# EAGLE design DRUM_1_MAIN_6 (EAGLE 9.6.2)
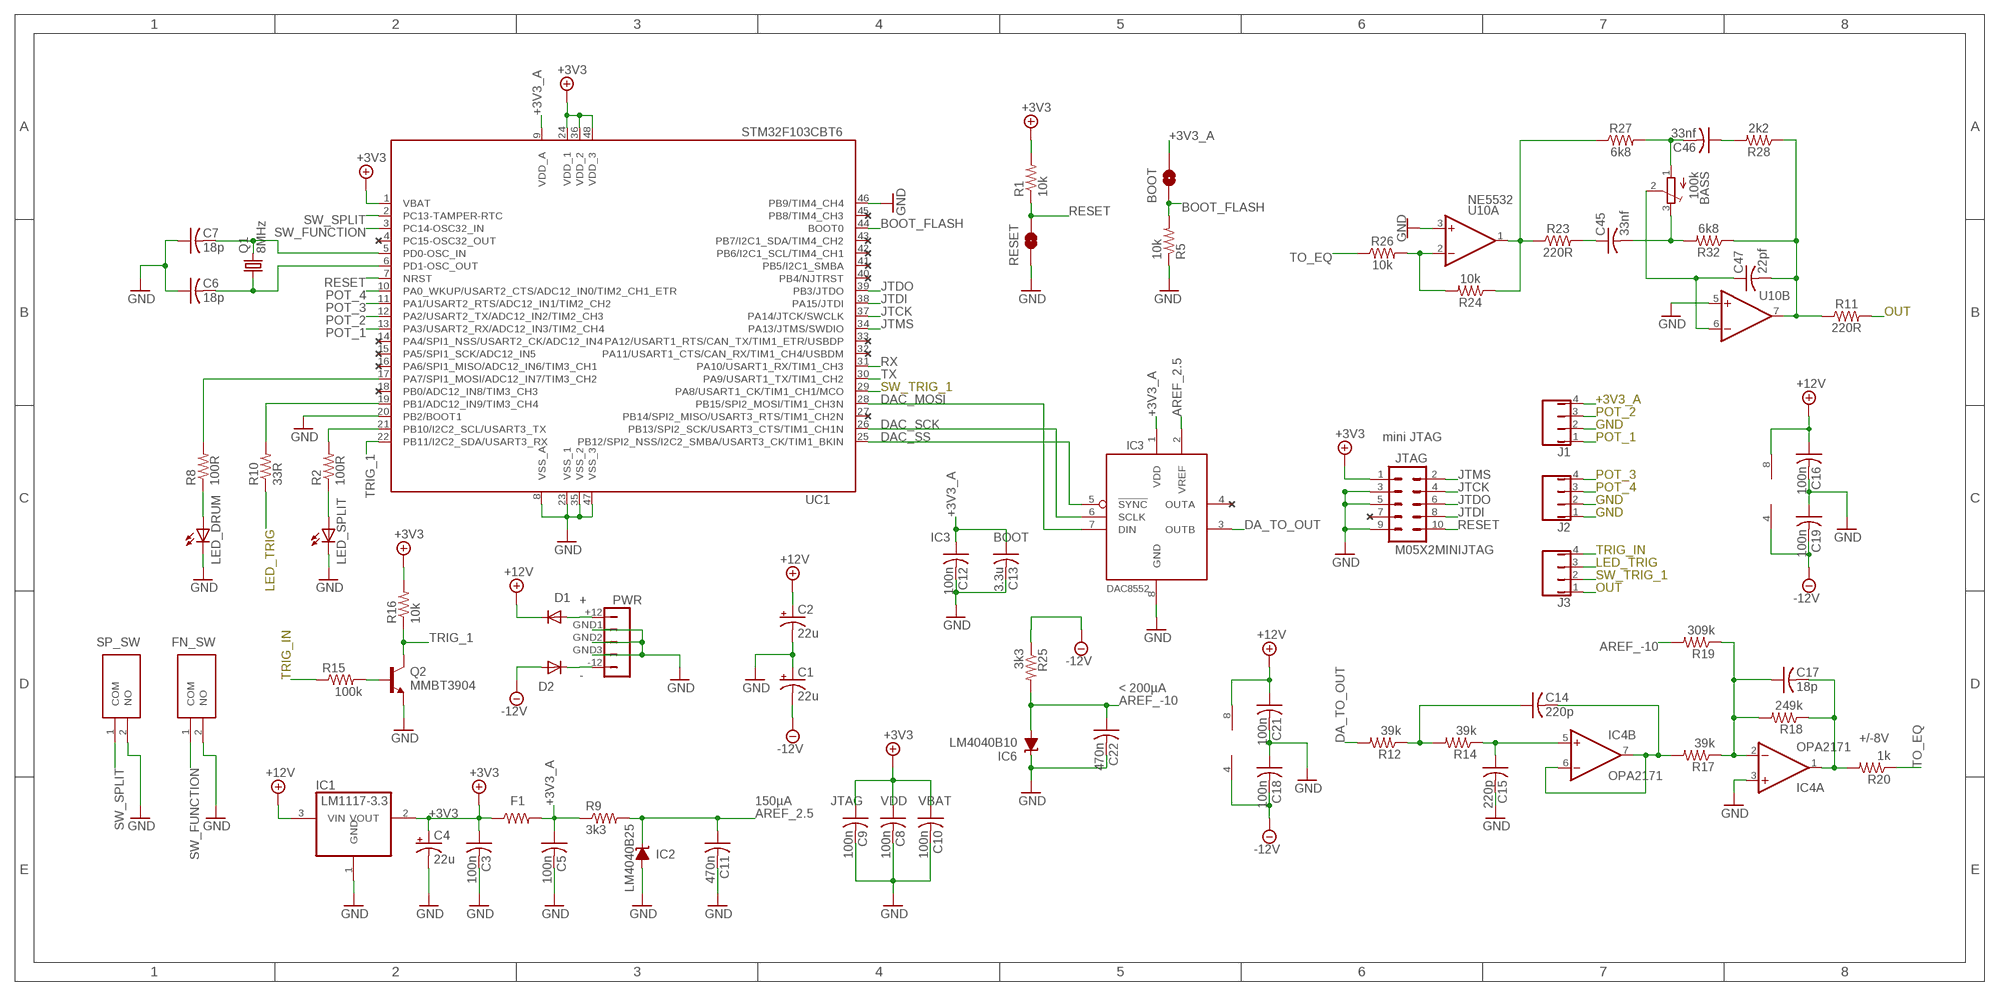
[diagram p0: schematic, sheet 1]

## Parts
BASS  100k  ADAFRUIT_TRIMPOTTC33X  [ADAFRUIT_TC33X]
BOOT  BOOT  JUMPER-SMT_2_NO_SILK  [SMT-JUMPER_2_NO_SILK]
C1  22u  CPOL-USC  [PANASONIC_C]
C2  22u  CPOL-USC  [PANASONIC_C]
C3  100n  C-USC0603  [C0603]
C4  22u  CPOL-USC  [PANASONIC_C]
C5  100n  C-USC0603  [C0603]
C6  18p  C-USC0603  [C0603]
C7  18p  C-USC0603  [C0603]
C8  100n  C-USC0603  [C0603]
C9  100n  C-USC0603  [C0603]
C10  100n  C-USC0603  [C0603]
C11  470n  C-USC0603  [C0603]
C12  100n  C-USC0603  [C0603]
C13  3.3u  C-USC0805K  [C0805K]
C14  220p  C-USC0603  [C0603]
C15  220p  C-USC0603  [C0603]
C16  100n  C-USC0603  [C0603]
C17  18p  C-USC0603  [C0603]
C18  100n  C-USC0603  [C0603]
C19  100n  C-USC0603  [C0603]
C21  100n  C-USC0603  [C0603]
C22  470n  C-USC0603  [C0603]
C45  33nf  C-USC0603  [C0603]
C46  33nf  C-USC0603  [C0603]
C47  22pf  C-USC0603  [C0603]
D1  1N5819HW  PWR_DIODE  [PNS40010ER_SOD123W]
D2  1N5819HW  PWR_DIODE  [PNS40010ER_SOD123W]
F1  742792693  R-US_R0603  [R0603]
FN_SW  PTS636_SM25_SMTR_LFS C778169  PTS636_SM25_SMTR_LFS  [PTS636SM25SMTRLFS]
IC1  LM1117-3.3  REG1117  [SOT223]
IC2  LM4040B25  LM4041B12DBZ  [DBZ_R-PDSO-G3]
IC3  DAC8552  [MSOP-8]
IC4  OPA2171  TL072D  [SO08]
IC6  LM4040B10  LM4041B12DBZ  [DBZ_R-PDSO-G3]
J1  1x4 FEMALE HEADER  JMP/4P/SIP  [JMP/4P/SIP]
J2  1x4 FEMALE HEADER  JMP/4P/SIP  [JMP/4P/SIP]
J3  1x4 FEMALE HEADER  JMP/4P/SIP  [JMP/4P/SIP]
JTAG  M05X2MINIJTAG  [2X5-1.27]
LED_DRUM  LEDS0805  [LED_0805A]
LED_SPLIT  LEDS0805  [LED_0805A]
PWR  JMP/5P/DIP1X5_HEADER  [JMP/5P/DIP]
Q1  8MHz  CRYSTALHC49UP  [HC49UP]
Q2  MMBT3904  MMBT3904LT1-NPN-SOT23-BEC  [SOT23-BEC]
R1  10k  R-US_R0603  [R0603]
R2  100R  R-US_R0603  [R0603]
R5  10k  R-US_R0603  [R0603]
R8  100R  R-US_R0603  [R0603]
R9  3k3  R-US_R0603  [R0603]
R10  33R  R-US_R0603  [R0603]
R11  220R  R-US_R0603  [R0603]
R12  39k  R-US_R0603  [R0603]
R14  39k  R-US_R0603  [R0603]
R15  100k  R-US_R0603  [R0603]
R16  10k  R-US_R0603  [R0603]
R17  39k  R-US_R0603  [R0603]
R18  249k  R-US_R0603  [R0603]
R19  309k  R-US_R0603  [R0603]
R20  1k  R-US_R0603  [R0603]
R23  220R  R-US_R0603  [R0603]
R24  10k  R-US_R0603  [R0603]
R25  3k3  R-US_R0603  [R0603]
R26  10k  R-US_R0603  [R0603]
R27  6k8  R-US_R0603  [R0603]
R28  2k2  R-US_R0603  [R0603]
R32  6k8  R-US_R0603  [R0603]
RESET  RESET  JUMPER-SMT_2_NO_SILK  [SMT-JUMPER_2_NO_SILK]
SP_SW  PTS636_SM25_SMTR_LFS C778169  PTS636_SM25_SMTR_LFS  [PTS636SM25SMTRLFS]
U10  NE5532  TL072D  [SO08]
UC1  STM32F103CBT6  STM32F103CB  [LQFP48]

## Nets
+ [+]: D1.2(A) PWR.+12
+3V3 [+3v3]: C3.1 C4.+ C8.1 C9.1 C10.1 F1.1 IC1.2(VOUT) JTAG.1 R1.2 R16.2 UC1.1(VBAT) UC1.24(VDD_1) UC1.36(VDD_2) UC1.48(VDD_3)
+3V3_A [+3V3A]: BOOT.2 C5.1 C12.1 C13.1 F1.2 IC3.1(VDD) J1.4 R9.1 UC1.9(VDD_A)
+12V [+12V]: C2.+ C16.1 C21.1 D1.1(K) IC1.3(VIN) IC4.8(P:V+) U10.8(P:V+)
- [-]: D2.1(K) PWR.-12
-12V [-12V]: C1.- C18.2 C19.2 D2.2(A) IC4.4(P:V-) R25.1 U10.4(P:V-)
AREF_2.5: C11.1 IC2.1(C) IC3.2(VREF) R9.2
AREF_-10: C22.1 IC6.2(A) R19.2 R25.2
BI_OUT: C17.2 IC4.1(A:OUT) R18.1 R20.2
BOOT_FLASH: BOOT.1 R5.2 UC1.44(BOOT0)
DA_TO_OUT: IC3.3(OUTB) R12.2
DAC_MOSI: IC3.7(DIN) UC1.28(PB15/SPI2_MOSI/TIM1_CH3N)
DAC_SCK: IC3.6(SCLK) UC1.26(PB13/SPI2_SCK/USART3_CTS/TIM1_CH1N)
DAC_SS: IC3.5(!SYNC) UC1.25(PB12/SPI2_NSS/I2C2_SMBA/USART3_CK/TIM1_BKIN)
F_CV: C17.1 IC4.2(A:-IN) R17.1 R18.2 R19.1
GND [GND]: C1.+ C2.- C3.2 C4.- C5.2 C6.1 C7.1 C8.2 C9.2 C10.2 C11.2 C12.2 C13.2 C15.2 C16.2 C18.1 C19.1 C21.2 C22.2 FN_SW.2(NO) IC1.1(GND) IC2.2(A) IC3.8(GND) IC4.3(A:+IN) IC6.1(C) J1.2 J2.1 J2.2 JTAG.3 JTAG.5 JTAG.9 LED_DRUM.-(C) LED_SPLIT.-(C) PWR.GND1 PWR.GND2 PWR.GND3 Q2.E R5.1 RESET.1 SP_SW.2(NO) U10.3(A:+IN) U10.5(B:+IN) UC1.8(VSS_A) UC1.20(PB2/BOOT1) UC1.23(VSS_1) UC1.35(VSS_2) UC1.46(PB9/TIM4_CH4) UC1.47(VSS_3)
JTCK: JTAG.4 UC1.37(PA14/JTCK/SWCLK)
JTDI: JTAG.8 UC1.38(PA15/JTDI)
JTDO: JTAG.6 UC1.39(PB3/JTDO)
JTMS: JTAG.2 UC1.34(PA13/JTMS/SWDIO)
LED_TRIG: J3.3 R10.1
N$1: R24.2 R26.2 U10.2(A:-IN)
N$6: LED_DRUM.+(A) R8.1
N$7: C7.2 Q1.2 UC1.5(PD0-OSC_IN)
N$8: C6.2 Q1.1 UC1.6(PD1-OSC_OUT)
N$9: R10.2 UC1.19(PB1/ADC12_IN9/TIM3_CH4)
N$13: R8.2 UC1.17(PA7/SPI1_MOSI/ADC12_IN7/TIM3_CH2)
N$14: Q2.B R15.2
N$18: LED_SPLIT.+(A) R2.1
N$19: R2.2 UC1.21(PB10/I2C2_SCL/USART3_TX)
N$42: C14.2 IC4.6(B:-IN) IC4.7(B:OUT) R17.2
N$43: C15.1 IC4.5(B:+IN) R14.1
N$45: C14.1 R12.1 R14.2
N$78: C47.2 R11.1 R28.1 R32.1 U10.7(B:OUT)
N$87: BASS.2 C47.1 U10.6(B:-IN)
N$134: R23.1 R24.1 R27.1 U10.1(A:OUT)
N$146: C45.1 R23.2
N$147: BASS.1 C46.2 R27.2
N$148: BASS.3 C45.2 R32.2
N$150: C46.1 R28.2
OUT: J3.1 R11.2
POT_1: J1.1 UC1.13(PA3/USART2_RX/ADC12_IN3/TIM2_CH4)
POT_2: J1.3 UC1.12(PA2/USART2_TX/ADC12_IN2/TIM2_CH3)
POT_3: J2.4 UC1.11(PA1/USART2_RTS/ADC12_IN1/TIM2_CH2)
POT_4: J2.3 UC1.10(PA0_WKUP/USART2_CTS/ADC12_IN0/TIM2_CH1_ETR)
RESET: JTAG.10 R1.1 RESET.2 UC1.7(NRST)
RX: UC1.31(PA10/USART1_RX/TIM1_CH3)
SW_FUNCTION: FN_SW.1(COM) UC1.3(PC14-OSC32_IN)
SW_SPLIT: SP_SW.1(COM) UC1.2(PC13-TAMPER-RTC)
SW_TRIG_1: J3.2 UC1.29(PA8/USART1_CK/TIM1_CH1/MCO)
TO_EQ: R20.1 R26.1
TRIG_1: Q2.C R16.1 UC1.22(PB11/I2C2_SDA/USART3_RX)
TRIG_IN: J3.4 R15.1
TX: UC1.30(PA9/USART1_TX/TIM1_CH2)
Unconnected: IC3.4(OUTA) JTAG.7 UC1.4(PC15-OSC32_OUT) UC1.14(PA4/SPI1_NSS/USART2_CK/ADC12_IN4) UC1.15(PA5/SPI1_SCK/ADC12_IN5) UC1.16(PA6/SPI1_MISO/ADC12_IN6/TIM3_CH1) UC1.18(PB0/ADC12_IN8/TIM3_CH3) UC1.27(PB14/SPI2_MISO/USART3_RTS/TIM1_CH2N) UC1.32(PA11/USART1_CTS/CAN_RX/TIM1_CH4/USBDM) UC1.33(PA12/USART1_RTS/CAN_TX/TIM1_ETR/USBDP) UC1.40(PB4/NJTRST) UC1.41(PB5/I2C1_SMBA) UC1.42(PB6/I2C1_SCL/TIM4_CH1) UC1.43(PB7/I2C1_SDA/TIM4_CH2) UC1.45(PB8/TIM4_CH3)

## Notes on the sheet
- mini JTAG
- IC3 | BOOT
- < 200µA
- +/-8V
- 150µA | JTAG | VDD | VBAT

## Library data of the parts
BASS = AA_Stobbert_1:ADAFRUIT_TRIMPOT: SMT trimmer potentiometer part number TC33X http://www.ladyada.net/library/eagle
BOOT RESET = SparkFun-Jumpers:JUMPER-SMT_2_NO: Normally open jumper This jumper has two pads in close proximity to each other. Apply solder to close the connection. Round pads are easier to solder for beginners, but are a lot larger. SparkFun Product that uses the round pads: SparkFun EL Sequencer <https://www.sparkfun.com/products/12781>
C1 C2 C4 = rcl:CPOL-US: POLARIZED CAPACITOR, American symbol
C3 C5-C19 C21 C22 C46 = AA_Stobbert_1:C-US: CERAMIC CAPACITOR
C45 C47 = AA_Stobbert:C-US: CAPACITOR, American symbol
D1 D2 = AA_Stobbert_1:PWR_DIODE: 400 V, 1 A high power diode High power density, standard switching time PN-rectifier with high-efficiency planar technology, encapsulated in a small and flat lead SOD123W Surface-Mounted Device (SMD) plastic package. AAL Eindhoven MK
F1 R1 R2 R5 R8-R12 R14-R20 R23-R28 R32 = AA_Stobbert_1:R-US_: RESISTOR, 1%, 1/10 W
FN_SW SP_SW = SamacSys_Parts:PTS636_SM25_SMTR_LFS: Tactile Switches Tact 50mA 12VDC, 6.0x3.5, 2.5mm H, 180gf, G leads, No ground pin, White Actuator Source: Datasheet <https://componentsearchengine.com/Datasheets/1/PTS636 SM25 SMTR LFS.pdf>; DESCRIPTION: Tactile Switches Tact 50mA 12VDC, 6.0x3.5, 2.5mm H, 180gf, G leads, No ground pin, White Actuator; HEIGHT: 2.7mm; MANUFACTURER_NAME: C & K COMPONENTS; MANUFACTURER_PART_NUMBER: PTS636 SM25 SMTR LFS; MOUSER_PART_NUMBER: 611-PTS636SM25SMTRLF; MOUSER_PRICE-STOCK: https://www.mouser.co.uk/ProductDetail/CK/PTS636-SM25-SMTR-LFS?qs=vLWxofP3U2yIXR4iooxesw%3D%3D
IC1 = og-vreg:REG1117: 800mA and 1A Low Dropout (LDO) Positive Regulator 1.8V, 2.5V, 2.85V, 3.3V, 5V, and Adj
IC2 IC6 = texas:LM4041: PRECISION MICROPOWER SHUNT VOLTAGE REFERENCE Source: http://focus.ti.com/lit/ds/slcs146e/slcs146e.pdf
IC3 = og-dac:DAC8552
IC4 = linear:TL072: OP AMP
J1-J3 = AA_Stobbert_1:JMP/4P/SIP
JTAG = og-header:M05X2: Header 5x2 Standard 10-pin dual row 0.1" header. Commonly used with AVR-ISP. Use with Spark Fun Electronics SKU: PRT-00778
LED_DRUM LED_SPLIT = AA_Stobbert_1:LEDS
PWR = AA_Stobbert_1:JMP/5P/DIP
Q1 = crystal:CRYSTAL: CRYSTAL
Q2 = transistor:*-NPN-: NPN Transistror BF959 corrected 2008.03.06
U10 = TomW:TL072: OP AMP
UC1 = stm32:STM32F103CB

## Net classes
0 default: width 0.254 mm
1 +12V: width 0.305 mm
2 -12V: width 0.305 mm
3 +3v3: width 0.305 mm
4 +3V3A: width 0.305 mm
5 GND: width 0.254 mm
6 +: width 0.61 mm
7 -: width 0.61 mm

## Board
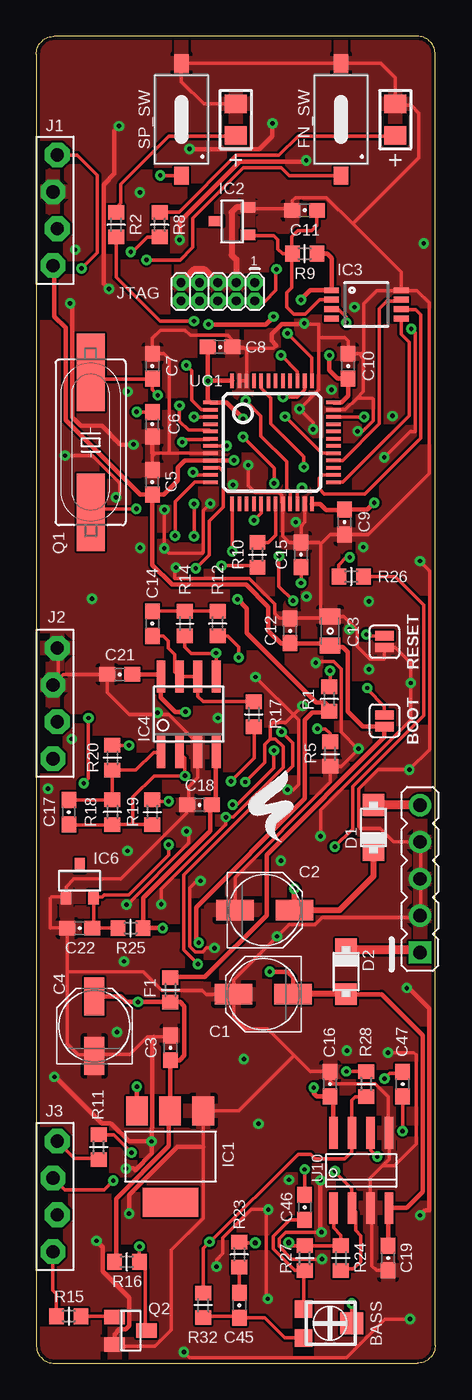
[diagram p1: board, top side]
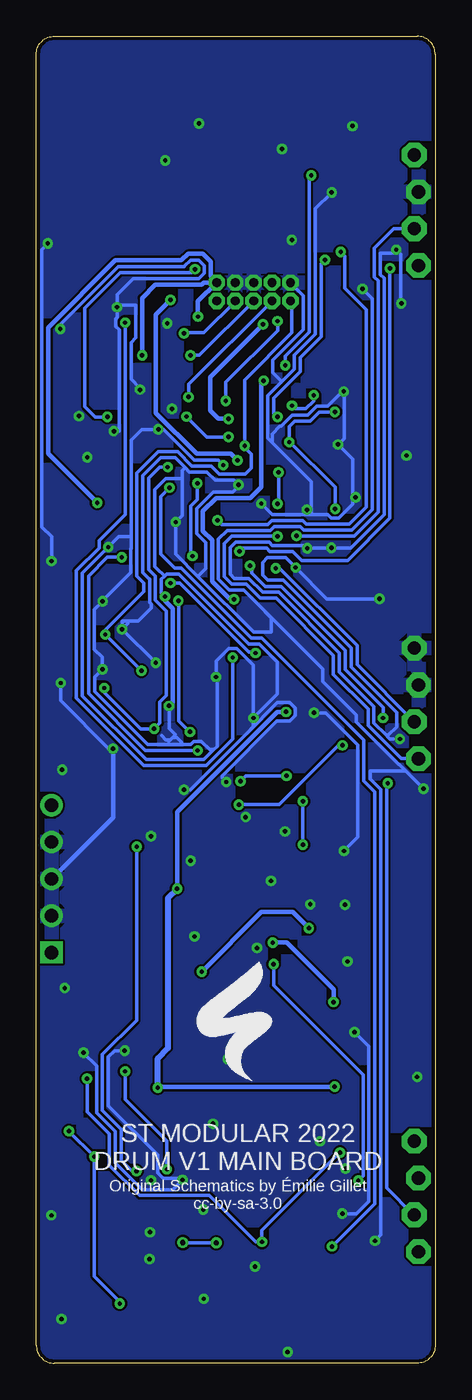
[diagram p2: board, bottom side, seen from below]

Size 27.5 x 91.5 mm. Coordinates in mm from the lower left corner, seen from the top.
Outline: 1.25,0 26.25,0 arc90 27.5,1.25 27.5,47.95 27.5,90.25 arc90 26.25,91.5 1.25,91.5 arc90 0,90.25 0,1.25 arc90 1.25,0
Copper layers (1*16): Top 0.035mm / dielectric 1.5mm / Bottom 0.035mm
Design rules "default *": minimum track width 6mil, minimum drill 0.3mm, track to track 6mil, track to pad 6mil, pad to pad 6mil, via to via 6mil, smd to smd 6mil, copper to edge 10mil, drill to drill 6mil, minimum pad ring 10mil, minimum via ring 8mil, stop-mask expansion 4mil, vias tented up to drill 15mil, thermal gap 10mil

### Footprints (pad centres in the part's own frame; a part is rotated, then mirrored left to right if it is on the bottom)
ADAFRUIT_TC33X = smd 1.2 x 1.2: 1 -1,-1.825; 3 1,-1.825 | smd 1.5 x 1.6: 2 0,1.5
SMT-JUMPER_2_NO_SILK = smd 0.635 x 1.27: 1 -0.406,0; 2 0.406,0
PANASONIC_C = smd 2.6 x 1.4: + 2.05,0; - -2.05,0
C0603 = smd 1.1 x 1: 1 -0.85,0; 2 0.85,0
C0805K = smd 1.1 x 1.4: 1 -1,0; 2 1,0
PNS40010ER_SOD123W = smd 1.5 x 1.5: 1 -1.55,0; 2 1.55,0
R0603 = smd 1 x 1.1: 1 -0.85,0; 2 0.85,0
PTS636SM25SMTRLFS = smd 1.25 x 1: 1 -3.875,0; 2 3.875,0
SOT223 = smd 1.499 x 2.007: 1 -2.261,-3.15; 2 0.025,-3.15; 3 2.311,-3.15 | smd 3.81 x 2.007: 4 0,3.15
DBZ_R-PDSO-G3 = smd 0.7 x 1: 1 -0.95,-1.1; 2 0.95,-1.1; 3 0,1.1
MSOP-8 = smd 0.41 x 1.02: 1 -0.975,-2.4; 2 -0.325,-2.4; 3 0.325,-2.4; 4 0.975,-2.4; 5 0.975,2.4; 6 0.325,2.4; 7 -0.325,2.4; 8 -0.975,2.4
SO08 = smd 0.6 x 2.2: 1 -1.905,-2.6; 2 -0.635,-2.6; 3 0.635,-2.6; 4 1.905,-2.6; 5 1.905,2.6; 6 0.635,2.6; 7 -0.635,2.6; 8 -1.905,2.6
JMP/4P/SIP = drill 0.914 pad 1.7 octagon: 1 -3.81,0.15; 2 -1.27,-0.15; 3 1.27,0.15; 4 3.81,-0.15
2X5-1.27 = drill 0.61 pad 1.067 octagon: 1 -1.27,3.81; 2 0,3.81; 3 -1.27,2.54; 4 0,2.54; 5 -1.27,1.27; 6 0,1.27; 7 -1.27,0; 8 0,0; 9 -1.27,-1.27; 10 0,-1.27
LED_0805A = smd 1.27 x 1.524: + 1.091,0; - -1.091,0
JMP/5P/DIP = drill 0.914 pad 1.524: +12 0,-5.08; GND1 0,2.54; GND2 0,0; GND3 0,-2.54 | drill 0.914 pad 1.524 square: -12 0,5.08
HC49UP = smd 5.334 x 1.93: 1 -4.826,0; 2 4.826,0
SOT23-BEC = smd 1 x 1.4: B -0.95,-1.1; C 0,1.1; E 0.95,-1.1
LQFP48 = smd 0.254 x 1: 1 -2.75,-4.25; 2 -2.25,-4.25; 3 -1.75,-4.25; 4 -1.25,-4.25; 5 -0.75,-4.25; 6 -0.25,-4.25; 7 0.25,-4.25; 8 0.75,-4.25; 9 1.25,-4.25; 10 1.75,-4.25; 11 2.25,-4.25; 12 2.75,-4.25; 25 2.75,4.25; 26 2.25,4.25; 27 1.75,4.25; 28 1.25,4.25; 29 0.75,4.25; 30 0.25,4.25; 31 -0.25,4.25; 32 -0.75,4.25; 33 -1.25,4.25; 34 -1.75,4.25; 35 -2.25,4.25; 36 -2.75,4.25 | smd 1 x 0.254: 13 4.25,-2.75; 14 4.25,-2.25; 15 4.25,-1.75; 16 4.25,-1.25; 17 4.25,-0.75; 18 4.25,-0.25; 19 4.25,0.25; 20 4.25,0.75; 21 4.25,1.25; 22 4.25,1.75; 23 4.25,2.25; 24 4.25,2.75; 37 -4.25,2.75; 38 -4.25,2.25; 39 -4.25,1.75; 40 -4.25,1.25; 41 -4.25,0.75; 42 -4.25,0.25; 43 -4.25,-0.25; 44 -4.25,-0.75; 45 -4.25,-1.25; 46 -4.25,-1.75; 47 -4.25,-2.25; 48 -4.25,-2.75

### Placement (x,y rotation side)
BASS  20.25,2.75 270 top
BOOT  24,44.3 270 top
C1  15.65,25.45 180 top
C2  15.75,31.25 0 top
C3  9.25,21.75 90 top
C4  4,23.25 90 top
C5  8,60.75 90 top
C6  8,64.75 90 top
C7  8,68.75 270 top
C8  12.67,70.07 0 top
C9  21.25,58 270 top
C10  21.5,68.75 90 top
C11  18.5,79.5 180 top
C12  17.5,50.5 90 top
C13  20.25,50.5 90 top
C14  8,51 270 top
C15  18.25,55.75 90 top
C16  20.25,19.25 90 top
C17  2.25,38 90 top
C18  11.25,38.5 0 top
C19  24.25,7.25 90 top
C21  5.75,47.5 180 top
C22  3,30 180 top
C45  14,4 270 top
C46  18.5,10.75 270 top
C47  25.25,19.25 90 top
D1  23.25,36.95 90 top
D2  21.35,27 270 top
F1  9.25,25.75 90 top
FN_SW  21,85.75 90 top
IC1  9.25,14.25 180 top
IC2  13.5,78.75 90 top
IC3  22.75,73 270 top
IC4  10.5,44.75 0 top
IC6  3,33.25 0 top
J1  1.3,79.5 270 top
J2  1.3,45.5 270 top
J3  1.3,11.5 270 top
JTAG  11.25,73.25 270 top
LED_DRUM  24.75,85.75 270 top
LED_SPLIT  13.75,85.75 270 top
PWR  26.45,33.4 180 top
Q1  3.75,63.5 90 top
Q2  6.5,2.25 270 top
R1  20.2,45.8 270 top
R2  5.5,78.5 270 top
R5  20.25,42 90 top
R8  8.5,78.5 270 top
R9  18.5,76.5 180 top
R10  15.25,55.75 90 top
R11  4.3,14.9 270 top
R12  12.5,51 270 top
R14  10.25,51 90 top
R15  2.25,3.25 0 top
R16  6.25,7 180 top
R17  15,44.75 90 top
R18  5.25,38 270 top
R19  8,38 90 top
R20  5.25,41.75 270 top
R23  14,7.5 270 top
R24  21,7.25 270 top
R25  6.5,30 180 top
R26  21.7,54.25 0 top
R27  18.5,7.25 270 top
R28  22.75,19.25 90 top
R32  11.5,4 270 top
RESET  24,49.75 90 top
SP_SW  10,85.75 90 top
U10  22.4,13.3 0 top
UC1  16.25,63.5 270 top

### Tracks (layer width: path | path; a pad name or v marks a point on that pad's centre or on a via)
+
  Top 0.61: D1.2 26.38,38.5 PWR.+12
+3V3  (via drill 0.3)
  Top 0.305: UC1.36 21.03,66.25 21.5,66.72 C10.1 20.79,67.9 20.2,68.49 v20.2,69.5 | UC1.24 19.57,59.25 19.98,58.84 C9.1 22.82,58.85 v23.3,59.33 | R16.2 5.5,7 5.5,11.35 9.12,14.98 9.12,17.38 IC1.2 9.25,17.5 9.25,20.88 C3.1 9.9,20.9 10.21,21.22 10.21,24.62 9.94,24.9 F1.1 v7.01,24.91 6.2,24.91 5.81,25.3 C4.+ | C8.1 11.83,70.05 v11.83,67.75 | v16.36,72.17 15.81,71.62 v11.88,71.62 | v11.2,29 11.02,29.19 11.02,31.45 18.51,38.93 18.51,44.37 19.02,44.88 20.12,44.88 R1.2 20.2,45.24 19.89,45.56 19.29,45.56 14.5,50.34 14.5,52.05 v13.88,52.68 | v11.83,67.75 11.83,66.42 UC1.1 13.12,66.25 v14.25,65.12 | v11.83,67.75 UC1.48
  Bottom 0.305: v20.2,69.5 20.2,73.46 19.29,74.37 16.11,74.37 15.96,74.52 JTAG.1 | v11.2,29 10.23,29 7.01,25.78 v7.01,24.91 | v11.88,71.62 15.5,68.01 15.5,65.67 14.95,65.12 v14.25,65.12 | v16.36,72.17 16.36,73.22 JTAG.1 | v11.83,67.75 11.98,67.6 11.98,60.41 12.73,59.65 15.11,59.65 16.01,58.75 16.01,57.39 15.38,56.76 15.38,53.89 14.17,52.68 v13.88,52.68 | v23.3,59.33 26.69,62.72 26.69,71.41 22.05,76.05 17.49,76.05 17.04,76.5 16.9,76.5 16.89,76.5 16.04,76.5 15.49,75.95 15.49,74.95 JTAG.1
+3V3_A  (via drill 0.3)
  Top 0.305: F1.2 9.25,26.62 11.62,26.62 15.88,30.88 15.88,35.04 24,43.17 BOOT.2 22.5,43.89 21.46,44.93 21.46,49.03 21.11,49.38 20.25,49.38 C13.1 20.12,49.62 17.5,49.62 C12.1 17.38,49.62 16.88,49.62 16.01,50.49 16.01,52.14 14.47,53.68 9.37,53.68 8,55.05 C5.1 | R9.1 20.05,76.5 20.36,76.19 20.36,73.98 IC3.1 20.34,73.98 18.9,73.98 v18.24,73.33 | v13.62,62.25 12.12,62.25 UC1.9 10.25,62.25 9.76,61.76 9.76,60.88 8.78,59.9 C5.1 | J1.4 1.25,75.62 1.25,72.17 2.02,71.39 2.02,65.04 7.17,59.9 C5.1
  Bottom 0.305: v18.24,73.33 19.26,72.31 19.26,65.53 16.44,62.71 14.08,62.71 v13.62,62.25
+12V  (via drill 0.3)
  Top 0.305: C21.1 8.38,47.5 8.5,47.38 IC4.8 8.6,45.91 9.6,44.91 v10.28,44.91 | U10.8 20.48,15.91 20.48,18.14 20.25,18.38 C16.1 19.34,18.4 19.12,18.62 v19.12,19 | v6.93,19.07 v6.94,19.06 IC1.3 | C2.+
  Top 0.406: v17.79,32.71 C2.+ | C2.+ 20.91,31.25 23.25,33.59 D1.1
  Bottom 0.305: v19.12,19 19.06,19.07 v6.93,19.07 | v10.28,44.91 10.9,44.91 17.79,38.02 v17.79,32.71
  Bottom 0.406: v19.12,19 19.12,21.03 18.43,21.73 18.43,32.08 v17.79,32.71
-
  Top 0.61: D2.1 21.38,28.5 26.25,28.5 26.38,28.38 PWR.-12
-12V  (via drill 0.3)
  Top 0.305: IC4.4 12.38,42.12 12.38,38.88 12.12,38.62 C18.2 12,38.5 12,36.71 7.38,32.09 7.38,30 R25.1 7.5,30 v8.71,30 | C19.2 24.25,8.12 24.25,10.62 U10.4 25.53,10.7 26.64,11.81 26.64,22.62 23.81,25.45 D2.2 21.25,25.5 | 17.75,25.5 C1.- 17.7,26.62 17.33,26.99 v16.09,26.99
  Top 0.406: 17.75,25.5 21.25,25.5
  Bottom 0.305: v8.71,30 9.82,31.11 11.98,31.11 v16.09,26.99
AREF_2.5
  Top 0.254: IC2.1 14.62,77.75 16.38,77.75 16.66,77.46 16.66,76.81 16.98,76.5 17.62,76.5 | 17.62,76.5 R9.2 17.62,76.38 17.62,74.18 17.25,73.81 17.25,72.83 17.74,72.34 18.55,72.34 19.54,73.33 IC3.2 | C11.1 19.35,78.44 18.99,78.09 18.02,78.09 17.62,77.69 17.62,76.5
AREF_-10  (via drill 0.3)
  Top 0.254: v9.12,38.75 8,38.75 R19.2 | R25.2 C22.1 3.95,30.1 IC6.2 4.53,32.15 4.69,32.3 6.38,32.3 9.14,35.06 9.14,35.73 v9.12,35.75
  Bottom 0.254: v9.12,35.75 v9.12,38.75
BI_OUT
  Top 0.254: IC4.1 8.5,42.12 8.1,42.12 6.87,40.9 R20.2 R18.1 C17.2
BOOT_FLASH  (via drill 0.3)
  Top 0.254: v18.44,61.8 18.44,62.52 16.18,64.78 16.18,66.55 15.5,67.22 UC1.44 | v19.38,43.75 19.93,43.75 20.25,43.43 R5.2 | v22.82,46.56 22.82,46.48 24,45.3 BOOT.1
  Bottom 0.254: v22.82,46.56 22.82,46.25 20.32,43.75 v19.38,43.75 18.98,44.15 18.98,45.59 18.54,46.03 18.54,51.87 19.29,52.62 19.29,54.27 19.75,54.73 19.75,61.04 18.99,61.8 v18.44,61.8
DA_TO_OUT  (via drill 0.3)
  Top 0.254: v21.38,71.75 21.38,72.12 20.88,72.62 20.38,72.62 IC3.3 | v13.96,48.67 13.96,49.4 13.21,50.15 R12.2
  Bottom 0.254: v21.38,71.75 21.38,58.5 23.17,56.71 23.17,56.23 24.75,54.65 24.75,45.87 20.09,41.21 15.78,41.21 13.96,43.03 v13.96,48.67
DAC_MOSI
  Top 0.254: UC1.28 21.12,62.25 23.65,64.78 23.65,72.73 24.17,73.25 25.12,73.25 IC3.7
DAC_SCK
  Top 0.254: UC1.26 19.71,61.25 19.5,61.04 19.5,60.3 19.86,59.94 22.65,59.94 26.52,63.8 26.52,72.32 26.17,72.66 25.18,72.66 IC3.6
DAC_SS
  Top 0.254: UC1.25 21.12,60.75 25.7,65.33 25.7,70.41 25.15,70.96 IC3.5
F_CV  (via drill 0.3)
  Top 0.254: C17.1 2.25,37.12 5.25,37.12 R18.2 5.32,37.14 6.67,37.14 | 6.67,37.14 8,37.14 R19.1 | IC4.2 9.88,42.12 10.25,41.75 v10.25,40.5 10.12,40.5 8.12,40.5 6.67,39.04 6.67,37.14 | R17.1 15.01,41.72 v13.43,40.14
  Bottom 0.254: v13.43,40.14 13.05,40.51 10.26,40.51 v10.25,40.5
GND  (via drill 0.3)
  Top 0.254: LED_SPLIT.- 11.53,86.84 10,88.38 SP_SW.2 FN_SW.2 23.75,89.62 24.75,88.62 LED_DRUM.- 24.75,86.75 25.83,86.75 26.38,86.21 26.38,83.12 21.81,78.56 | 17.5,51.38 20.12,51.38 C13.2 | 17.5,51.38 C12.2 | C13.2 19.62,51.5 19.62,56.47 | 14.56,79.74 IC2.2 14.62,79.62 17.5,79.62 17.62,79.5 C11.2 17.65,80.15 17.88,80.38 20,80.38 21.81,78.56 | UC1.8 9.16,62.75 9.16,62.76 | 8,63.88 C6.1 | 9.16,62.76 9.16,69.23 8.78,69.6 C7.1 8,70.68 8.57,71.25 10.25,71.25 10.62,70.88 13.21,70.88 13.52,70.56 C8.2 | UC1.47 UC1.46 14.5,69.85 14.28,70.07 C8.2 | UC1.35 21.31,65.75 22.11,66.55 | 22.11,66.55 22.54,66.98 22.54,69.27 22.21,69.6 C10.2 | 16.55,70.17 16.38,70 13.75,70 C8.2 | J2.1 1.5,49.25 1.5,47.25 J2.2 1.25,46.88 1.88,47.5 C21.2 4.9,46.25 6.4,44.75 9.12,44.75 11.12,42.75 11.12,42.25 IC4.3 11.12,42.12 11.12,40.38 10.5,39.75 10.5,38.5 C18.1 10.38,38.38 10.38,37.96 5.82,33.4 2.59,33.4 2.05,32.86 IC6.1 1.06,32.15 0.95,32.05 0.95,30 C22.2 2.12,29.88 2.12,27 | Q2.E 5.52,1.18 7.14,1.18 8.18,1.18 9.32,2.32 9.32,7.82 11.5,10 11.5,14.93 11.5,17.38 IC1.1 13.96,17.4 17.78,21.22 | C3.2 9.25,22.5 8.1,22.5 7.63,22.5 6.45,21.31 4.11,21.31 C4.- 4,21.25 2.91,21.25 2.12,22.03 2.12,27 | 13.75,31.25 C2.- 13.7,33.52 20.25,40.06 R5.1 21.04,41.15 22.21,42.32 v22.21,42.37 | C19.1 23.46,6.4 23.12,6.73 23.12,10.62 U10.3 23.03,10.71 23.03,12.78 23.85,13.6 | 23.85,13.6 24.31,14.06 24.31,15.89 U10.5 24.25,16 24.25,18.38 23.38,19.25 20.48,19.25 20.25,19.48 C16.2 20.25,20.12 18.88,20.12 17.78,21.22 | 17.78,21.22 16.56,22.44 15.93,23.07 14.44,23.07 13.6,23.91 C1.+ | 14,25 C1.+ | v22.21,42.37 22.32,42.26
  Top 0.254: 2.12,27 7.38,27 8.65,25.72 11.45,25.72 11.71,25.45 C1.+ | IC3.8 26.24,73.97 27.09,73.13 27.09,61.34 22.9,57.15 C9.2 21.25,57.12 20.28,57.12 19.62,56.47 | IC3.8 25.15,75.22 21.81,78.56 | IC3.8 23.48,73.97 22.56,73.05 22.56,69.77 22.39,69.6 C10.2 | C10.2 21.5,70.49 21.28,70.71 19.49,70.71 | 18.47,71.66 19.49,71.66 19.49,70.71 | C15.2 17.43,56.6 17,57.03 UC1.20 16.91,59.34 16.91,59.87 16.74,60.03 15.09,60.03 14.61,60.51 v14.61,61.93 | C15.2 18.25,57.74 18.5,57.99 UC1.23 | C15.2 19.5,56.6 19.62,56.47 | C13.2 21.19,51.5 22.11,50.58 22.11,49.41 22.97,48.55 24,48.55 RESET.1 24.75,49.34 25.81,48.28 v25.81,46.91 25.81,44.35 19.6,38.14 v19.6,36.34 | C1.+ 13.6,26.44 17.43,30.27 19.22,30.27 19.7,30.75 26.38,30.75 PWR.GND1 26.5,30.88 26.5,33.38 PWR.GND2 26.5,33.5 26.5,35.88 PWR.GND3 24.65,35.94 23.7,36.89 22.34,36.89 22.22,37.01 22.22,39.59 23.56,40.93 v25.72,40.93 27.12,42.33 27.12,54.63 v26.44,55.31 | 9.16,62.76 9.15,62.75 8.19,62.75 | 8.19,62.75 8,62.75 | v17.32,39.54 17.7,39.54 18.08,39.92 18.08,44.34 v15.1,47.31 | 19.49,70.71 19.49,67.14 v18.15,65.81 19.09,64.87 v19.09,64.39 | v6.23,31.62 6.28,31.62 10.53,35.86 10.53,36.51 v10.36,36.68 | v12.29,28.63 11.73,28.63 11.47,28.37 10.94,28.37 10.57,28.74 10.57,32.77 11.06,33.26 v11.31,33.26 | v8.61,31.64 8.61,32.7 13.07,37.15 v13.07,37.66 13.58,37.66 17.01,41.09 17.01,42.51 16.49,43.03 16.12,43.03 | v12.43,6.67 12.43,7.15 12.85,7.57 12.85,8.65 14.8,10.6 v15.99,10.6 15.84,10.45 15.84,4.56 v15.95,4.44 | v10.17,0.78 10.57,0.38 21.37,0.38 24.04,3.05 v25.77,3.05 | C5.2 8,62.56 8.19,62.75 | v22.15,64.27 22.51,64.27 23.23,64.99 23.23,66.48 23.16,66.55 22.11,66.55
  Top 0.254: v23.98,62.46 25.77,64.24 26.11,64.24 26.11,71.06 v25.85,71.32 | v5.5,59.71 5.76,59.97 5.76,60.69 3.87,62.58 v1.98,62.58 | v19.27,48.3 19.35,48.38 20.51,48.38 21.03,47.87 21.03,43.52 22.17,42.37 v22.21,42.37 | 23.85,13.6 24.67,13.6 26.2,15.13 26.2,21.25 26.03,21.42 v24.25,21.42 | v11.99,59.27 11.51,58.79 11.51,55.92 11.47,55.88 9.14,55.88 v8.82,56.2 8.82,58.84 v8.83,58.85 | v9.62,54.86 9.55,54.8 9.55,54.12 14.67,54.12 16.44,52.35 16.44,51.69 16.75,51.38 17.5,51.38 | 16.12,43.03 16.12,43.96 16.32,44.17 17.18,44.17 v18.35,45.33 | 16.12,43.03 15.74,42.66 15.74,41.42 v14.4,40.08 | v19.7,7.18 17.61,7.18 16.74,8.05 16.74,8.59 17.18,9.03 v19.67,9.03
  Top 0.305: C6.1 8,62.75 | v5.7,85.31 5.39,85 5.39,82.03 4.64,81.28 4.64,74.44 v5.01,74.07 | v9.88,77.46 9.88,78.71 14.03,82.86 18.53,82.86 v18.61,82.93 | v10.56,83.73 12.85,83.73 12.86,83.72 15.38,83.72 16.28,84.62 v16.28,85.49 | v6.7,63.35 5.8,63.35 4.5,64.66 3.07,64.66 2.48,65.24 2.48,72.93 v2.34,73.08 | v26.46,10.2 26.81,10.55 27.09,10.55 27.09,24.47 25.69,25.88 v25.54,25.88 | v19.59,12.62 19.59,9.11 v19.67,9.03 | v6.4,10.31 6.4,11.61 9.72,14.93 11.5,14.93 | v7.95,15.3 6.4,15.3 5.15,16.55 4.51,16.55 1.31,19.75 v1.25,19.75 | v7.95,15.3 7.95,16.23 7.99,16.27 7.99,22.39 8.1,22.5 | v6.18,13.43 6.7,13.43 6.82,13.31 7.97,14.47 7.97,15.28 v7.95,15.3 | v4.16,8.45 4.59,8.01 4.59,6.32 6.41,4.51 6.41,2.57 6.16,2.33 5.73,2.33 5.4,2 Q2.E | 18.47,71.66 16.92,71.66 16.22,70.97 16.22,70.51 16.55,70.17
  Top 0.406: JTAG.9 10.34,74.88 10.34,74.9 10.87,75.43 11.63,75.43 12.16,74.9 12.16,74.88 JTAG.5 JTAG.3 13.79,76.1 13.47,76.42 13.47,79.36 13.81,79.7 IC2.2
  Bottom 0.254: v25.81,46.91 25.81,45.68 22.5,42.37 v22.21,42.37 | v2.34,73.08 2.38,73.12 2.38,76.48 v2.69,76.78 2.75,76.85 | v11.99,59.27 11.23,58.51 8.54,58.51 | 8.54,58.51 7.4,58.51 7.16,58.28 6.64,58.28 5.68,59.24 5.68,62.33 v6.7,63.35 6.29,63.77 6.29,66.98 v6.31,67 6.42,67 7.42,66.01 8.15,66.01 8.78,65.38 9.85,65.38 10.61,64.62 10.7,64.62 11.24,64.08 11.24,63.5 9.95,62.22 | 8.54,58.51 8.54,60.8 9.95,62.22 | v26.44,55.31 26.44,56.99 27.12,57.67 27.12,76.8 v26.71,77.21 | 15.26,42.31 15.95,41.62 19.92,41.62 24.32,46.02 24.32,54.5 v22.53,56.28 21.83,56.99 20.97,56.99 20.97,57.14 | 15.26,42.31 15.04,42.53 15.04,47.25 v15.1,47.31 15.1,48.42 14.22,49.3 13.7,49.3 12.53,48.13 v12.53,44.5 | v17.32,39.54 16.88,39.54 12.95,43.47 | 12.95,43.47 12.53,43.89 v12.53,44.5 | v18.35,45.33 18.35,43.78 17.91,43.34 18.09,43.16 | 18.09,43.16 18.26,42.98 | 18.26,42.98 18.38,42.86 | 18.26,42.98 18.56,42.98 18.86,43.28 | 18.09,43.16 17.83,43.16 17.48,42.81 | v4.16,8.45 3.75,8.85 3.75,39.57 4.47,40.29 4.47,40.85 2.04,40.85 v0.82,39.62 2.48,41.28 2.52,41.28 5.45,44.21 5.45,44.69 7.76,47 7.76,47.87 12.21,52.32 | v6.3,35.33 5.33,36.3 5.33,42.63 7.55,44.85 v8.36,44.85 | v24.25,21.42 23.34,20.52 23.34,17.27 22.05,15.98 22.05,13.82 20.21,11.97 18.09,11.97 v17.42,12.64 17.51,12.74 18.76,12.74 19.13,13.11 19.13,14.36 22.53,17.76 22.53,21.12 22.11,21.55 v21.41,21.55 | v6.4,10.31 5.43,10.31 4.57,11.18 4.57,21.83 v5.56,22.83 | 2.62,76.56 3.79,76.56 3.79,75.07 3.53,74.82 3.53,58.53 5.83,56.23 v7.16,56.23 7.19,56.2 v8.82,56.2 9.01,56.39 11.24,56.39 11.46,56.61 13.76,56.61 14.13,56.24 14.13,54.4 13.85,54.12 12.86,54.12 11.9,53.16 10.79,53.16 6.61,48.98 6.61,47.67 4.23,45.28 4.23,44.16 3.37,43.3 3.29,43.3
  Bottom 0.254: v5.01,74.07 4.34,73.41 4.34,58.88 5.76,57.46 9.07,57.46 9.31,57.7 11.09,57.7 11.36,57.43 14.33,57.43 14.95,56.81 14.95,54.07 14.19,53.31 13.2,53.31 12.21,52.32 | v3.84,52.71 7.47,52.71 v9.62,54.86 v9.62,54.87 10.29,55.54 11.57,55.54 11.9,55.22 11.9,54.36 11.53,54 10.48,54 5.8,49.31 5.8,48 2.66,44.87 2.66,43.88 3.24,43.3 3.29,43.3 | v2.44,43.05 3.13,43.05 3.29,43.2 3.29,43.3 | v12.53,44.5 10.88,46.14 10.88,48.36 12.13,49.6 12.85,49.6 17.68,54.43 18.51,54.43 18.69,54.25 | v18.62,52.87 18.88,53.12 18.88,54.06 18.69,54.25 | 15.26,42.31 15.54,42.31 16.12,42.88 16.64,42.88 16.87,42.66 19.81,42.66 23.48,46.32 23.48,47.31 v22.94,47.85 22.94,48.68 23.49,49.23 23.49,51.97 v22.93,52.54 22.93,52.58 20.97,54.54 20.97,56.18 20.97,56.95 20.97,57.14 | 20.97,57.14 20.97,63.43 20.97,63.66 20.24,64.39 v19.09,64.39 18.73,64.39 16.62,62.28 14.96,62.28 v14.61,61.93 | 9.95,62.22 11.54,63.81 11.54,66.71 10.57,67.69 | JTAG.9 9.09,73.63 9.09,71.27 11.2,69.16 11.2,68.31 10.57,67.69 | v7.14,80.73 8.26,79.6 8.26,70.95 9.71,69.5 9.71,68.55 10.57,67.69 | v19.27,48.3 21.57,50.6 | 21.57,50.6 v21.59,50.6 21.18,51.02 21.18,51.18 | v14.4,40.08 14.7,40.37 14.7,40.5 10.92,44.28 10.02,44.28 9.65,44.65 9.65,45.17 10.02,45.54 10.88,45.54 12.95,43.47 | v20.35,67.13 20.35,67.23 20.97,67.85 20.97,70.37 20.63,70.71 20.63,72.93 20.65,72.95 21.81,72.95 v21.93,72.82 | v22.15,64.27 21.8,64.27 21.78,64.28 21.78,71.26 22.01,71.49 22.01,72.01 21.93,72.09 v21.93,72.82 | 21.57,50.6 21.57,51.18 21.18,51.18 | 17.24,61.75 16.95,61.46 15.74,61.46 15.16,60.89 13.87,60.89 v13.56,60.57 13.56,60.47 13.94,60.09 15.29,60.09 16.44,58.93 16.44,57.21 15.81,56.58 15.81,54.81 16.36,54.26
  Bottom 0.254: 17.24,61.75 17.93,62.44 18.93,62.44 20.15,61.21 20.15,54.53 19.7,54.08 19.69,54.08 19.69,52.45 19.58,52.34 19.58,52.07 20.47,51.18 21.18,51.18 | 12.21,52.32 11.29,51.4 11.29,50.41 12.52,50.41 16.36,54.26 | 16.36,54.26 17.89,55.79 v17.89,57.99 v17.88,58 17.43,58.45 17.43,61.11 | 17.24,61.75 17.43,61.55 17.43,61.11 | 18.69,54.25 18.69,54.3 19.14,54.76 19.33,54.95 19.33,60.26 18.58,61.01 17.53,61.01 17.43,61.11 | v21.93,72.82 21.93,73.67 20.8,74.8 16.29,74.8 15.92,75.17 15.92,75.7 16.29,76.07 16.86,76.07 17.29,75.64 17.29,75.61 21.86,75.61 25.85,71.63 v25.85,71.32
  Bottom 0.305: PWR.GND2 22.21,37.64 v22.21,42.37 | v18.35,45.33 18.11,45.57 18.11,52.05 18.62,52.56 v18.62,52.87
  other vias: 15.31,16.52 14.31,20.97 6.05,27.7 16.59,29.43 16.86,34.65 18.48,71.7 24.55,65.32
  pour Top: -1,93.5 -1,-1.5 29,-1.5 29,93.5
  pour Bottom: -2,95.5 -2,-2.5 30,-2.5 30,95.5
JTCK  (via drill 0.3)
  Top 0.254: UC1.37 19,69.33 v17.32,71
  Bottom 0.254: v17.32,71 17.28,71.05 15.95,71.05 13.75,73.25 JTAG.4
JTDI  (via drill 0.3)
  Top 0.254: UC1.38 18.5,67.12 18,66.62 v17,66.62
  Bottom 0.254: v17,66.62 17,67.5 JTAG.8
JTDO  (via drill 0.3)
  Top 0.254: UC1.39 18,68.38 v16.88,69.5
  Bottom 0.254: v16.88,69.5 16.25,69.5 12.5,73.25 JTAG.6
JTMS  (via drill 0.3)
  Top 0.254: v22.6,65.25 UC1.34 | v16.55,75.43 16.52,75.4 16.52,74 15.77,73.25 JTAG.2
  Bottom 0.254: v22.6,65.25 23.43,65.25 24.15,65.97 24.15,72.75 21.69,75.21 16.78,75.21 v16.55,75.43
LED_TRIG  (via drill 0.3)
  Top 0.254: v12.77,54.98 12.79,55 15.25,55 R10.1 | v3.59,44.49 v3.59,44.48 3.59,40.31 v3.27,40
  Bottom 0.254: J3.3 1.5,10.25 3.35,12.1 3.35,39.92 v3.27,40 | v3.59,44.49 3.59,45.23 6.21,47.84 6.21,49.15 10.63,53.57 11.73,53.57 12.64,54.47 12.64,54.85 v12.77,54.98
N$1  (via drill 0.3)
  Top 0.254: R24.2 21,6.5 21.86,6.5 22.38,7.01 22.38,8.79 22.01,9.16 22.01,10.46 U10.2 21.75,10.75 21.75,12.03 20.58,13.2 v20.58,13.25 | R26.2 24.76,54.25 26.71,52.3 26.71,44.66 21.81,39.76 21.81,36.85 v20.58,35.62
  Bottom 0.254: v20.58,35.62 20.58,23.65 22.94,21.29 22.94,17.43 21.65,16.14 21.65,14 20.89,13.25 v20.58,13.25
N$6
  Top 0.254: R8.1 8.5,79.38 9.84,79.38 13.75,83.29 16.72,83.29 18.06,84.62 24.75,84.62 LED_DRUM.+
N$7  (via drill 0.3)
  Top 0.254: UC1.5 11.91,64.34 10.5,64.34 9.87,64.97 v9.87,66.03 | v8.38,66.75 7.99,67.13 7.99,67.54 8,67.53 C7.2 7.88,67.88 4.12,67.88 3.75,68.25 Q1.2
  Bottom 0.254: v9.87,66.03 9.64,65.81 8.93,65.81 8.38,66.36 v8.38,66.75
N$8  (via drill 0.3)
  Top 0.254: UC1.6 11.93,63.68 10.22,63.68 v10.06,63.52 | C6.2 v6.92,65.6 v6.92,65.59 | v6.9,58.91 3.91,58.91 3.75,58.75 Q1.1
  Bottom 0.254: v6.92,65.59 7.99,65.59 8.61,64.97 9.68,64.97 10.06,64.59 v10.06,63.52 10.06,63.56 6.9,60.4 v6.9,58.91
N$9
  Top 0.254: UC1.19 16.5,57.12 15.98,56.6 R10.2
N$13  (via drill 0.3)
  Top 0.254: UC1.17 15.5,58.62 v15,58.12 | R8.2 7.66,77.65 6.63,76.62 v6.52,76.62
  Bottom 0.254: v6.52,76.62 6.24,76.34 6.24,74.14 4.75,72.65 4.75,59.05 5.93,57.87 8.9,57.87 9.14,58.11 11.26,58.11 11.53,57.84 14.71,57.84 v14.99,58.12 v15,58.12
N$14
  Top 0.254: R15.2 3.12,3.25 5.38,3.25 Q2.B
N$18
  Top 0.254: LED_SPLIT.+ 13.75,84.62 9.14,84.62 5.82,81.31 5.82,79.98 5.5,79.65 R2.1
N$19  (via drill 0.3)
  Top 0.254: UC1.21 17.5,60.07 17.25,60.32 17.25,62.18 15.48,63.94 15.48,65.32 v14.44,66.37 | v10.86,71.86 8.53,71.86 5.5,74.89 R2.2
  Bottom 0.254: v14.44,66.37 14.44,67.64 10.86,71.21 v10.86,71.86
N$42
  Top 0.254: R17.2 15,45.62 11.5,45.62 11.13,45.99 IC4.6 IC4.7 9.55,47.66 9.55,48.86 9.11,49.31 9.11,49.79 8.74,50.15 C14.2
N$43  (via drill 0.3)
  Top 0.254: v18.25,53.8 18.25,54.88 C15.1 | IC4.5 12.4,48.95 v12.39,48.97 12.37,48.95 10.69,48.95 10.25,49.39 R14.1
  Bottom 0.254: v12.39,48.97 12.45,49.03 12.86,49.03 17.62,53.8 v18.25,53.8
N$45
  Top 0.254: C14.1 8,51.88 10.25,51.88 R14.2 10.38,51.88 12.5,51.88 R12.1
N$78  (via drill 0.3)
  Top 0.254: R32.1 11.5,4.88 11.5,7.93 v11.94,8.37 12,8.37 18.04,14.41 18.93,14.41 19.23,14.11 21.27,14.11 21.75,14.59 21.75,15.89 U10.7 21.75,15.91 21.75,18.13 22,18.38 22.75,18.38 R28.1 | v6.57,14.53 v6.56,14.53 5.34,15.75 R11.1 | v24,19.62 24.38,20 25.25,20 C47.2
  Bottom 0.254: v6.57,14.53 11.94,9.16 v11.94,8.37 12.37,8.37 15.57,11.57 20.38,11.57 22.46,13.65 22.46,15.81 24,17.35 v24,19.62
N$87  (via drill 0.3)
  Top 0.254: v25.25,16 25.25,18.38 C47.1 | v23.5,14.25 23.06,14.69 23.06,15.89 U10.6 | v21.75,4.12 BASS.2
  Bottom 0.254: v25.25,16 v23.5,14.25 23.5,5.99 21.75,4.24 v21.75,4.12
N$134  (via drill 0.35)
  Top 0.254: U10.1 20.5,9.32 21,8.82 R24.1 21,8.12 20.98,8.1 R27.1 17.62,8.1 v17.4,8.32 | v15.1,8.3 14.04,8.3 R23.1
  Bottom 0.254: v17.4,8.32 17.38,8.3 v15.1,8.3
N$146
  Top 0.254: C45.1 14,4.88 14,6.62 R23.2
N$147
  Top 0.254: BASS.1 18.43,6.33 R27.2 17.82,6.4 16.34,7.88 16.34,8.76 17.47,9.9 C46.2
N$148
  Top 0.254: R32.2 11.5,3.25 14,3.25 C45.2 15.74,3.15 17.14,1.75 18.38,1.75 BASS.3
N$150  (via drill 0.3)
  Top 0.254: v18.5,13.38 18.5,11.62 C46.1 | v21.38,20.12 22.75,20.12 R28.2
  Bottom 0.254: v18.5,13.38 18.5,15.33 21.38,18.21 v21.38,20.12
OUT
  Top 0.254: R11.2 4.25,14.12 2.62,14.12 1.5,15.25 J3.1
POT_1  (via drill 0.3)
  Top 0.254: v13.5,55.98 UC1.13 | J1.1 2.83,83.31 4.21,81.94 4.21,76.58 v3.12,75.5
  Bottom 0.254: v3.12,75.5 3.12,58.28 6.05,55.36 9.21,55.36 9.83,55.98 11.4,55.98 11.62,56.2 13.27,56.2 v13.5,55.98
POT_2  (via drill 0.3)
  Top 0.254: UC1.12 10.92,60.75 9.57,59.4 9.57,57.07 v9.56,57.05
  Bottom 0.254: v9.56,57.05 5.58,57.05 3.94,58.7 3.94,74.63 4.2,74.89 4.2,76.88 2.85,78.23 J1.3
POT_3  (via drill 0.3)
  Top 0.254: UC1.11 10.98,61.25 v10.8,61.43 | v10.88,59.26 v10.88,57.03 v10.87,57.02
  Bottom 0.254: v10.88,59.26 10.8,59.34 v10.8,61.43 | J2.4 2.35,41.69 4.63,43.97 4.63,44.06 4.63,45.11 7.02,47.5 7.02,48.81 10.96,52.75 12.07,52.75 13.03,53.72 14.02,53.72 14.54,54.23 14.54,56.51 14.02,57.02 v10.87,57.02
POT_4  (via drill 0.3)
  Top 0.254: UC1.10 12.62,61.75 12.88,61.5 12.88,59.02 11.91,58.06 11.91,55.73 v10.99,54.81
  Bottom 0.254: v10.99,54.81 10.72,54.81 5.39,49.48 5.39,48.17 J2.3
RESET  (via drill 0.3)
  Top 0.254: v20.25,47.75 20.25,46.75 R1.1 | v22.75,50.25 22.84,50.16 RESET.2 | v13.12,63.25 UC1.7
  Bottom 0.254: v20.25,47.75 v22.75,50.25 22.75,50.57 20.1,53.23 20.1,53.81 20.56,54.27 20.56,61.38 19.1,62.84 17.76,62.84 16.79,61.87 15.45,61.87 14.87,61.3 13.11,61.3 12.7,61.71 12.7,62.69 13.12,63.12 v13.12,63.25 13.12,67.81 9.88,71.06 9.88,73.25 JTAG.10
SW_FUNCTION  (via drill 0.3)
  Top 0.254: v10.88,65.25 UC1.3 | v7.6,76.08 9.92,76.08 10.79,76.94 10.79,78.95 14.26,82.42 16.89,82.42 17.44,81.88 FN_SW.1
  Bottom 0.254: v10.88,65.25 11.12,65.49 11.12,66.56 9.3,68.38 9.3,69.33 7.86,70.78 7.86,75.82 v7.6,76.08
SW_SPLIT  (via drill 0.3)
  Top 0.254: v10.34,68.81 10.72,68.43 10.72,66.4 11.38,65.75 UC1.2 | SP_SW.1 8.57,81.88 v8.54,81.9
  Bottom 0.254: v10.34,68.81 10.34,69.44 8.67,71.11 8.67,81.78 v8.54,81.9
SW_TRIG_1  (via drill 0.3)
  Top 0.254: UC1.29 19.67,62.75 v17.14,65.28 | v14.25,63.88 14.25,63.86 16.4,61.72 v16.4,60.67 | v17.71,52.58 16.73,53.56 v16.73,55.66 | v16.91,43.53 17.66,42.78 17.66,41.17 10.16,33.67 10.16,28.49 v11.14,27.52 | J3.2 1.95,11.97 4.67,11.97 v5.31,12.6
  Bottom 0.254: v14.25,63.88 15.74,63.88 v17.14,65.28 | v17.71,52.58 17.67,52.55 17.67,44.3 v16.91,43.53 | v11.14,27.52 11.14,26.04 4.97,19.87 4.97,12.93 v5.31,12.6 | v16.4,60.67 16.4,59.55 16.85,59.1 16.85,55.78 v16.73,55.66
TO_EQ  (via drill 0.3)
  Top 0.254: v6.39,42.6 R20.1 | v21.6,55.58 21.38,55.58 20.85,55.05 R26.1 | v13.54,38.51 13.86,38.51 16.38,41.03 v16.38,42.25
  Bottom 0.254: v6.39,42.6 6.67,42.6 10.76,38.52 v13.53,38.52 v13.54,38.51 | v21.6,55.58 22.62,55.58 23.9,54.3 23.9,46.17 19.98,42.25 v16.38,42.25
TRIG_1  (via drill 0.3)
  Top 0.254: v18.32,60.38 18,60.06 UC1.22 | v7.12,8.06 7.1,8.04 R16.1 7.12,6.88 7.5,6.5 7.5,2.25 Q2.C
  Bottom 0.254: v7.12,8.06 4.16,11.01 4.16,39.4 4.92,40.16 4.92,42.97 11.96,50.01 12.68,50.01 17.51,54.84 17.95,54.84 18.92,55.81 18.92,59.77 v18.32,60.38
TRIG_IN
  Top 0.254: J3.4 1.15,5.03 1.38,4.8 1.38,3.25 R15.1

### Text on the board
tPlace: 1
bPlace: ST MODULAR 2022 / DRUM V1 MAIN BOARD | Original Schematics by Émilie Gillet / cc-by-sa-3.0